# EAGLE design merak (EAGLE 7.2.0)
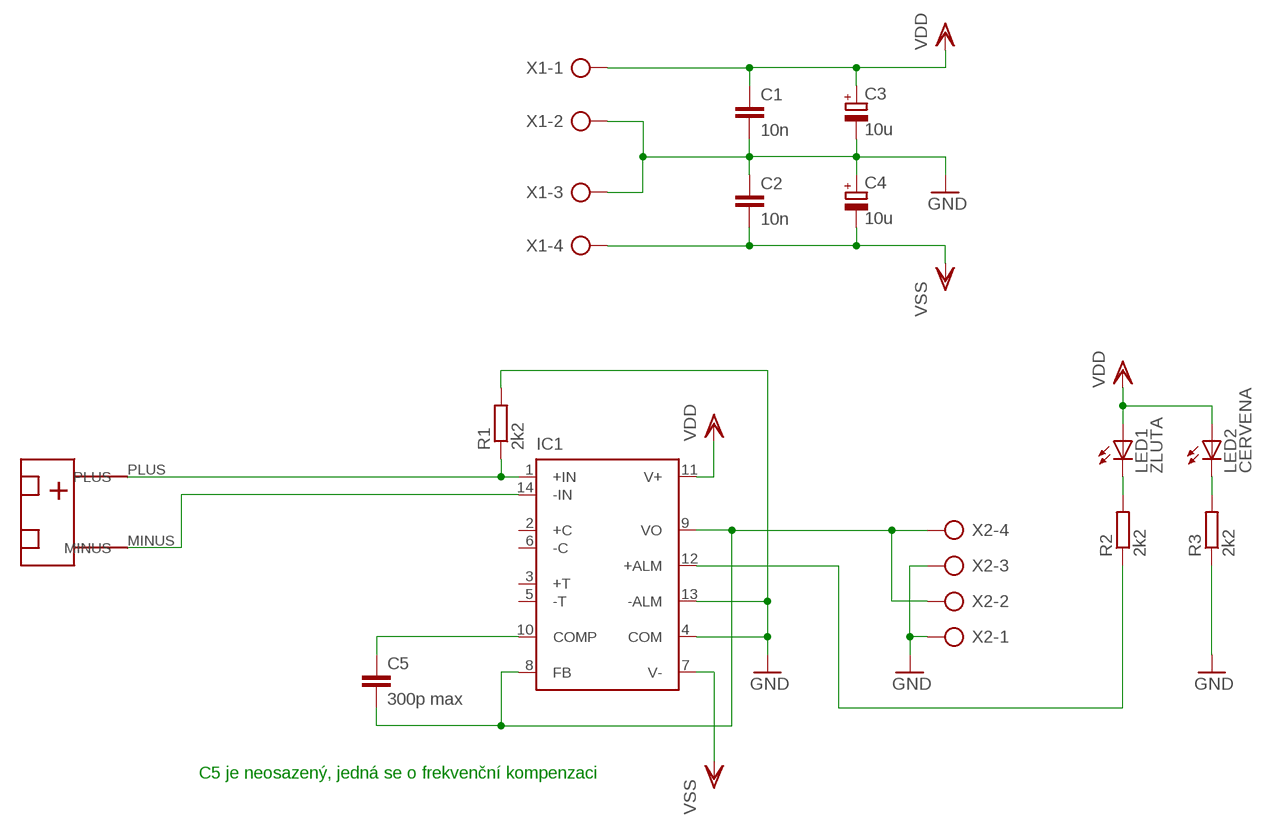
[diagram p0: schematic, sheet 1]

## Parts
C1  10n  C-EUC0805  [C0805]
C2  10n  C-EUC0805  [C0805]
C3  10u  CPOL-EUE2.5-5  [E2,5-5]
C4  10u  CPOL-EUE2.5-5  [E2,5-5]
C5  300p max  C-EUC0805  [C0805]
IC1  AD595  [DIL14]
LED1  ZLUTA  LED3MM  [LED3MM]
LED2  CERVENA  LED3MM  [LED3MM]
R1  2k2  R-EU_R0805  [R0805]
R2  2k2  R-EU_R0805  [R0805]
R3  2k2  R-EU_R0805  [R0805]
U$1  TERM_ZAS  [TERM_ZAS]
X1  AK300/4  [AK300/4]
X2  AK300/4  [AK300/4]

## Nets
GND: C1.2 C2.1 C3.- C4.+ IC1.4(COM) IC1.13(-ALM) R1.2 R3.1 X1.2 X1.3 X2.1 X2.3
MINUS: IC1.14(-IN) U$1.MINUS
N$1: C5.2 IC1.8(FB) IC1.9(VO) X2.2 X2.4
N$4: C5.1 IC1.10(COMP)
N$5: LED1.K(C) R2.2
N$6: LED2.K(C) R3.2
N$7: IC1.12(+ALM) R2.1
PLUS: IC1.1(+IN) R1.1 U$1.PLUS
VDD: C1.1 C3.+ IC1.11(V+) LED1.A LED2.A X1.1
VSS: C2.2 C4.- IC1.7(V-) X1.4
Unconnected: IC1.2(+C) IC1.3(+T) IC1.5(-T) IC1.6(-C)

## Notes on the sheet
- C5 je neosazený, jedná se o frekvenční kompenzaci

## Library data of the parts
C1 C2 C5 = rcl:C-EU: CAPACITOR, European symbol
C3 C4 = rcl:CPOL-EU: POLARIZED CAPACITOR, European symbol
IC1 = analog-devices:AD595: ANALOG DEVICES; MPN: AD595AQ; OC_FARNELL: 409194; OC_NEWARK: 06WX1596
LED1 LED2 = led:LED: LED OSRAM: - CHIPLED LG R971, LG N971, LY N971, LG Q971, LY Q971, LO R971, LY R971 LH N974, LH R974 LS Q976, LO Q976, LY Q976 LO Q996 - Hyper CHIPLED LW Q18S LB Q993, LB Q99A, LB R99A - SideLED LS A670, LO A670, LY A670, LG A670, LP A670 LB A673, LV A673, LT A673, LW A673 LH A674 LY A675 LS A676, LA A676, LO A676, LY A676, LW A676 LS A679, LY A679, LG A679 - Hyper Micro SIDELED® LS Y876, LA Y876, LO Y876, LY Y876 LT Y87S - SmartLED LW L88C, LW L88S LB L89C, LB L89S, LG L890 LS L89K, LO L89K, LY L89K LS L896, LA L896, LO L896, LY L896 - TOPLED LS T670, LO T670, LY T670, LG T670, LP T670 LSG T670, LSP T670, LSY T670, LOP T670, LYG T670 LG T671, LOG T671, LSG T671 LB T673, LV T673, LT T673, LW T673 LH T674 LS T676, LA T676, LO T676, LY T676, LB T676, LH T676, LSB T676, LW T676 LB T67C, LV T67C, LT T67C, LS T67K, LO T67K, LY T67K, LW E67C LS E67B, LA E67B, LO E67B, LY E67B, LB E67C, LV E67C, LT E67C LW T67C LS T679, LY T679, LG T679 LS T770, LO T770, LY T770, LG T770, LP T770 LB T773, LV T773, LT T773, LW T773 LH T774 LS E675, LA E675, LY E675, LS T675 LS T776, LA T776, LO T776, LY T776, LB T776 LHGB T686 LT T68C, LB T68C - Hyper Mini TOPLED® LB M676 - Mini TOPLED Santana® LG M470 LS M47K, LO M47K, LY M47K Source: http://www.osram.convergy.de LUXEON: - LUMILED® LXK2-PW12-R00, LXK2-PW12-S00, LXK2-PW14-U00, LXK2-PW14-V00 LXK2-PM12-R00, LXK2-PM12-S00, LXK2-PM14-U00 LXK2-PE12-Q00, LXK2-PE12-R00, LXK2-PE12-S00, LXK2-PE14-T00, LXK2-PE14-U00 LXK2-PB12-K00, LXK2-PB12-L00, LXK2-PB12-M00, LXK2-PB14-N00, LXK2-PB14-P00, LXK2-PB14-Q00 LXK2-PR12-L00, LXK2-PR12-M00, LXK2-PR14-Q00, LXK2-PR14-R00 LXK2-PD12-Q00, LXK2-PD12-R00, LXK2-PD12-S00 LXK2-PH12-R00, LXK2-PH12-S00 LXK2-PL12-P00, LXK2-PL12-Q00, LXK2-PL12-R00 Source: www.luxeon.com KINGBRIGHT: KA-3528ASYC Source: www.kingbright.com
R1-R3 = resistor:R-EU_: RESISTOR, European symbol
U$1 = breLib:TERM_ZAS
X1 X2 = con-ptr500:AK300/4: CONNECTOR; OC_FARNELL: unknown; OC_NEWARK: unknown

## Board
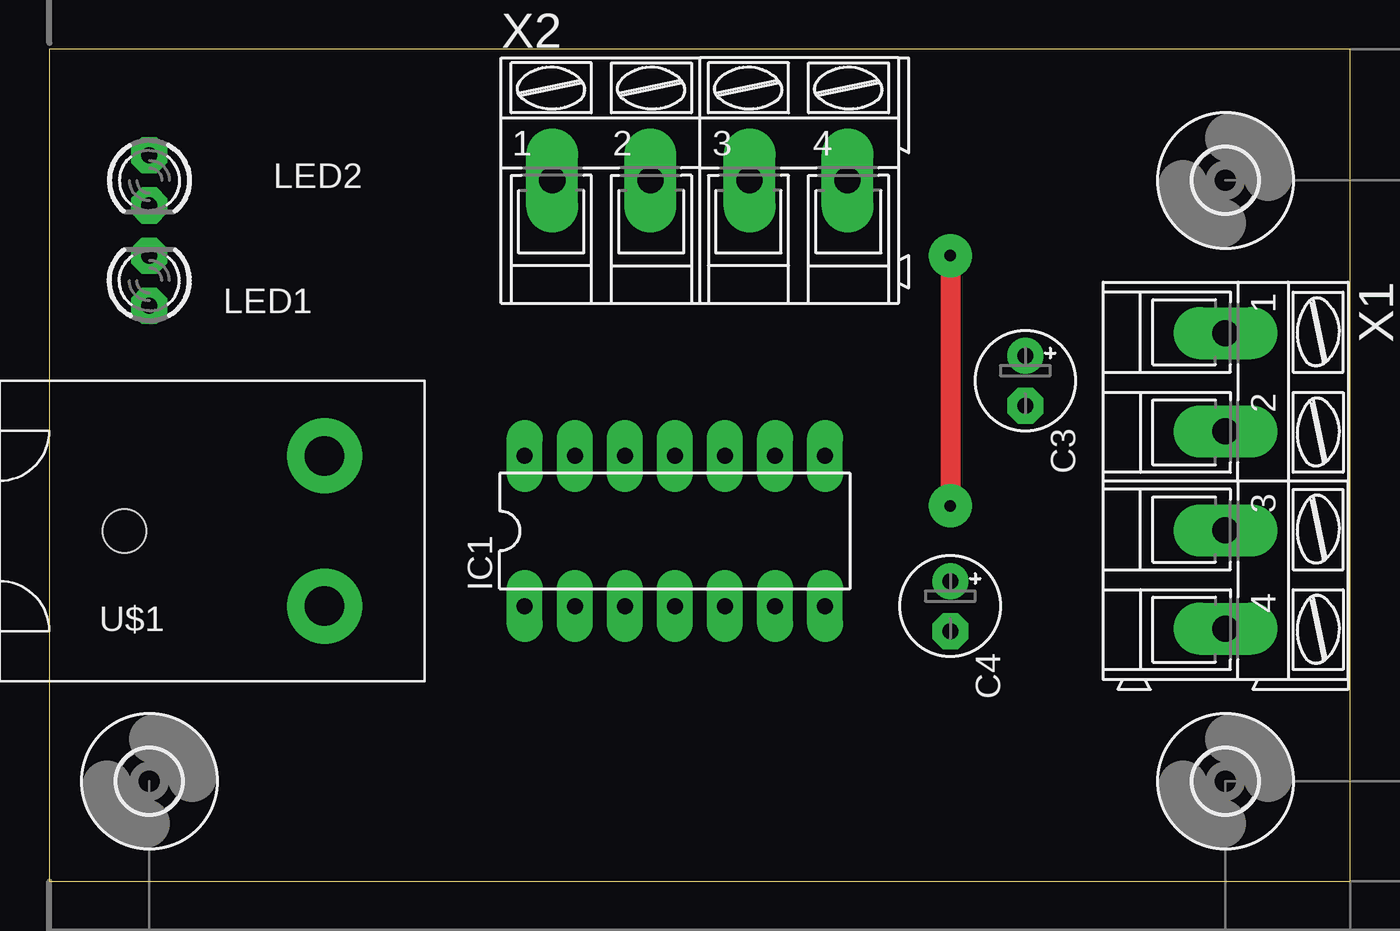
[diagram p1: board, top side]
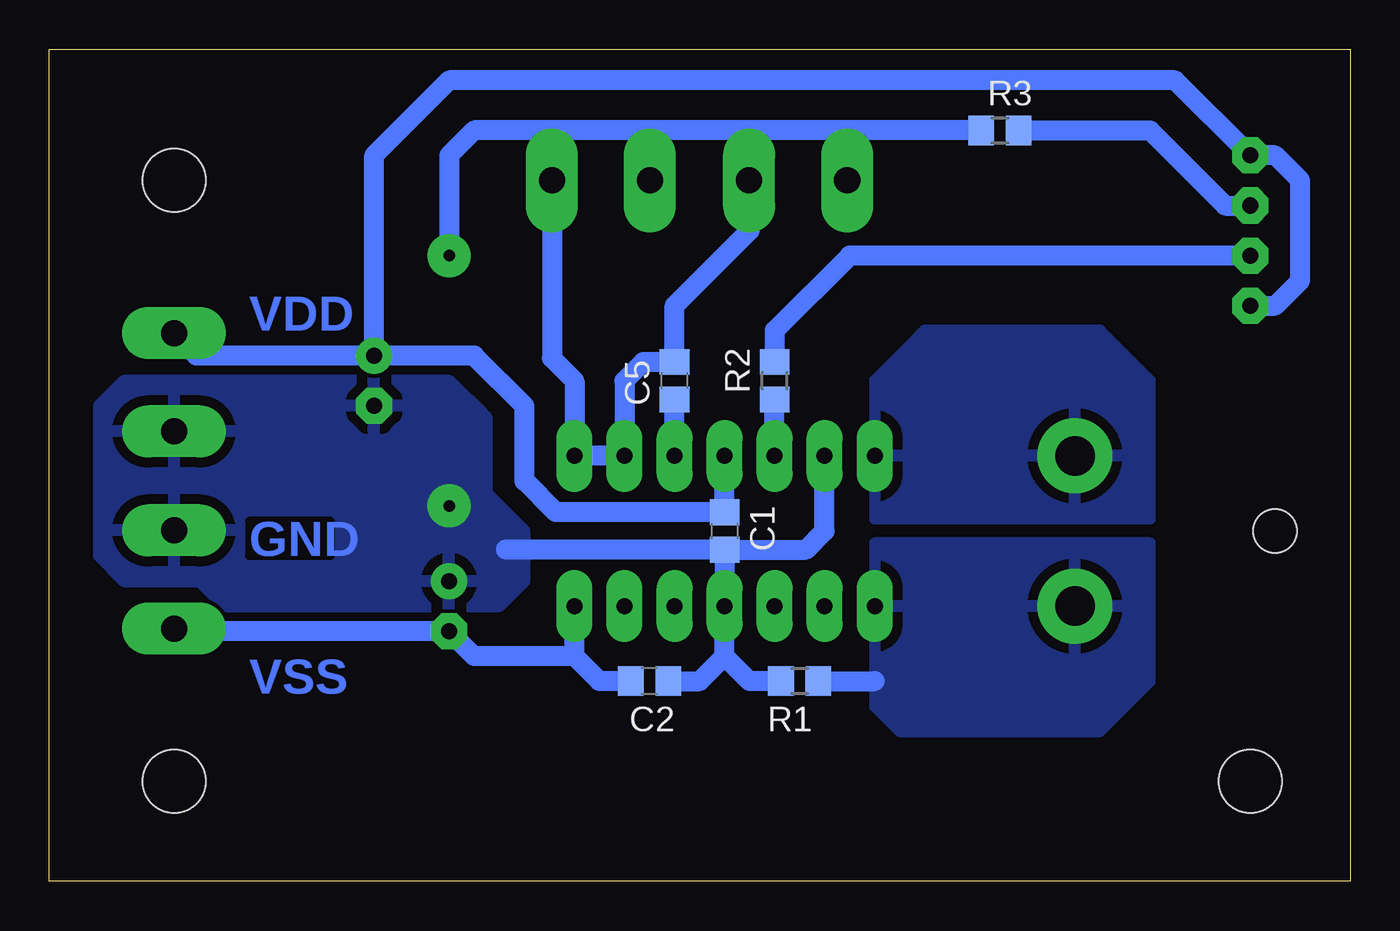
[diagram p2: board, bottom side, seen from below]

Size 66.02 x 42.22 mm. Coordinates in mm from the lower left corner, seen from the top.
Outline: 0,0 66.02,0 66.02,42.22 0,42.22 0,0
Copper layers (1*16): Top 0.035mm / dielectric 1.5mm / Bottom 0.035mm
Design rules "default *": minimum track width 10mil, minimum drill 24mil, track to track 8mil, track to pad 8mil, pad to pad 8mil, via to via 8mil, smd to smd 8mil, copper to edge 40mil, drill to drill 8mil, minimum pad ring 20mil, minimum via ring 8mil, stop-mask expansion 4mil, vias tented up to drill 0mil, thermal gap 20mil

### Footprints (pad centres in the part's own frame; a part is rotated, then mirrored left to right if it is on the bottom)
C0805 = smd 1.3 x 1.5: 1 -0.95,0; 2 0.95,0
E2,5-5 = drill 0.813 pad 1.6: + -1.27,0 | drill 0.813 pad 1.6 octagon: - 1.27,0
DIL14 = drill 0.813 long: 1 -7.62,-3.81; 2 -5.08,-3.81; 3 -2.54,-3.81; 4 0,-3.81; 5 2.54,-3.81; 6 5.08,-3.81; 7 7.62,-3.81; 8 7.62,3.81; 9 5.08,3.81; 10 2.54,3.81; 11 0,3.81; 12 -2.54,3.81; 13 -5.08,3.81; 14 -7.62,3.81
LED3MM = drill 0.813 octagon: A -1.27,0; K 1.27,0
R0805 = smd 1.3 x 1.5: 1 -0.95,0; 2 0.95,0
TERM_ZAS = drill 2 pad 3.81: MINUS 2.54,3.81; PLUS 2.54,-3.81 | hole 2.2: -7.62,0
3,2 = hole 3.2: 0,0
AK300/4 = drill 1.321 long: 1 -7.493,0; 2 -2.515,0; 3 2.515,0; 4 7.493,0

### Placement (x,y rotation side)
C1  31.75,17.78 270 bottom
C2  35.56,10.16 180 bottom
C3  49.53,25.4 270 top
C4  45.72,13.97 270 top
C5  34.29,25.4 90 bottom
IC1  31.75,17.78 0 top
LED1  5.08,30.48 90 top
LED2  5.08,35.56 270 top
R1  27.94,10.16 180 bottom
R2  29.21,25.4 90 bottom
R3  17.78,38.1 0 bottom
U$1  11.43,17.78 0 top
U$2  [3,2]  5.08,5.08 0 top
U$3  [3,2]  59.69,5.08 0 top
U$4  [3,2]  59.69,35.56 0 top
X1  59.69,20.32 270 top
X2  33.02,35.56 0 top

### Tracks (layer width: path | path; a pad name or v marks a point on that pad's centre or on a via)
GND  (via drill 0.6 pad 2.18)
  Top 1.016: v45.72,31.75 v45.72,19.05
  Bottom 1.016: v45.72,31.75 45.72,36.83 44.45,38.1 35.56,38.1 | C1.2 IC1.4 31.75,11.43 | C2.1 33.02,10.16 31.75,11.43 | R1.2 30.48,10.16 31.75,11.43 | C1.2 27.62,16.83 26.67,17.78 IC1.13 | C1.2 42.86,16.83 | X2.3 35.56,36.83 35.56,38.1 | R3.1 25.4,38.1 | 25.4,38.1 35.56,38.1 | X2.1 25.53,37.97 25.4,38.1
  pour Bottom: 45.72,25.4 62.23,25.4 63.5,24.13 63.5,16.51 62.23,15.24 58.42,15.24 57.15,13.97 43.18,13.97 41.91,15.24 41.91,17.78 43.81,19.68 43.81,23.5
MINUS
  pour Bottom: 24.13,18.41 10.16,18.41 10.16,25.4 12.7,27.94 21.59,27.94 24.13,25.4
N$1
  Bottom 1.016: X2.2 30.48,35.53 30.48,33.02 34.29,29.21 C5.2 35.88,26.35 36.83,25.4 IC1.9 IC1.8 39.37,25.4 40.51,26.54 X2.4
N$4
  Bottom 1.016: IC1.10 C5.1
N$5
  Bottom 1.016: LED1.K 25.4,31.75 29.21,27.94 R2.2
N$6
  Bottom 1.016: R3.2 10.16,38.1 6.35,34.29 LED2.K
N$7
  Bottom 1.016: IC1.12 R2.1
PLUS
  Bottom 1.016: R1.1 24.13,10.16
  pour Bottom: 10.16,17.14 24.13,17.14 24.13,8.89 22.86,7.62 12.7,7.62 10.16,10.16
VDD
  Bottom 1.016: C3.+ 49.53,36.83 45.72,40.64 8.89,40.64 LED2.A 3.81,36.83 2.54,35.56 2.54,30.48 3.81,29.21 LED1.A | IC1.11 C1.1 40.32,18.73 41.91,20.32 41.91,24.13 44.45,26.67 C3.+ | C3.+ 58.55,26.67 X1.1
VSS
  Bottom 1.016: C2.2 38.1,10.16 39.37,11.43 | 39.37,11.43 IC1.7 | X1.4 59.56,12.7 C4.- 44.45,11.43 39.37,11.43

### Text on the board
Bottom: VDD | GND | VSS